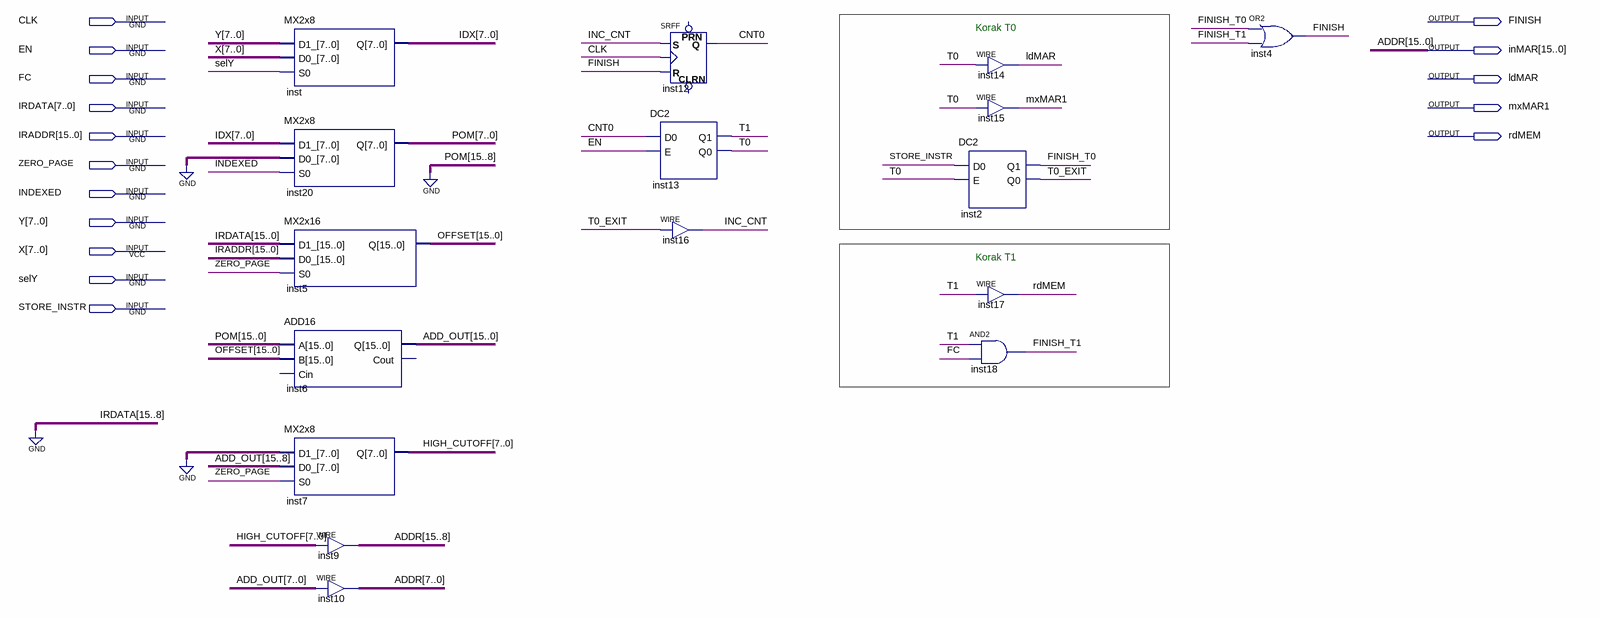
[diagram p0: schematic sheet]
// Quartus schematic zp_abs.bdf as structural Verilog: 16 symbols, 16 pins
module zp_abs (
  input  CLK,
  input  EN,
  input  FC,
  input  [7:0] IRDATA,
  input  [15:0] IRADDR,
  input  ZERO_PAGE,
  input  INDEXED,
  input  [7:0] Y,
  input  [7:0] X,
  input  selY,
  input  STORE_INSTR,
  output FINISH,
  output [15:0] inMAR,
  output ldMAR,
  output mxMAR1,
  output rdMEM
);

  wire CNT0, FINISH_T0, FINISH_T1, INC_CNT, T0, T0_EXIT, T1;
  wire [7:0] HIGH_CUTOFF, IDX, POM;
  wire [15:0] ADD_OUT, OFFSET;

  MX2x8 inst (.D1_(Y), .D0_(X), .S0(selY), .Q(IDX));
  MX2x8 inst20 (.D1_(IDX), .D0_({8{1'b0}}), .S0(INDEXED), .Q(POM));
  MX2x16 inst5 (.D1_({{8{1'b0}}, IRDATA}), .D0_(IRADDR), .S0(ZERO_PAGE), .Q(OFFSET));
  ADD16 inst6 (.A({{8{1'b0}}, POM}), .B(OFFSET), .Q(ADD_OUT));  // open: Cin, Cout
  MX2x8 inst7 (.D1_({8{1'b0}}), .D0_(ADD_OUT[15:8]), .S0(ZERO_PAGE), .Q(HIGH_CUTOFF));
  assign inMAR[15:8] = HIGH_CUTOFF;  // WIRE inst9
  assign inMAR[7:0] = ADD_OUT[7:0];  // WIRE inst10
  DC2 inst13 (.D0(CNT0), .E(EN), .Q1(T1), .Q0(T0));
  SRFF inst12 (.S(INC_CNT), .R(FINISH), .CLK(CLK), .Q(CNT0));  // open: PRN, CLRN
  assign INC_CNT = T0_EXIT;  // WIRE inst16
  assign ldMAR = T0;  // WIRE inst14
  assign mxMAR1 = T0;  // WIRE inst15
  DC2 inst2 (.D0(STORE_INSTR), .E(T0), .Q1(FINISH_T0), .Q0(T0_EXIT));
  assign rdMEM = T1;  // WIRE inst17
  and inst18 (FINISH_T1, T1, FC);
  or inst4 (FINISH, FINISH_T0, FINISH_T1);

  // Other names for the same wires on the sheet: ADDR[15:0] = inMAR

  // Notes on the sheet:
  //   Korak T0
  //   Korak T1
endmodule
